# Altium project smart-clock-main-board.PrjPcb
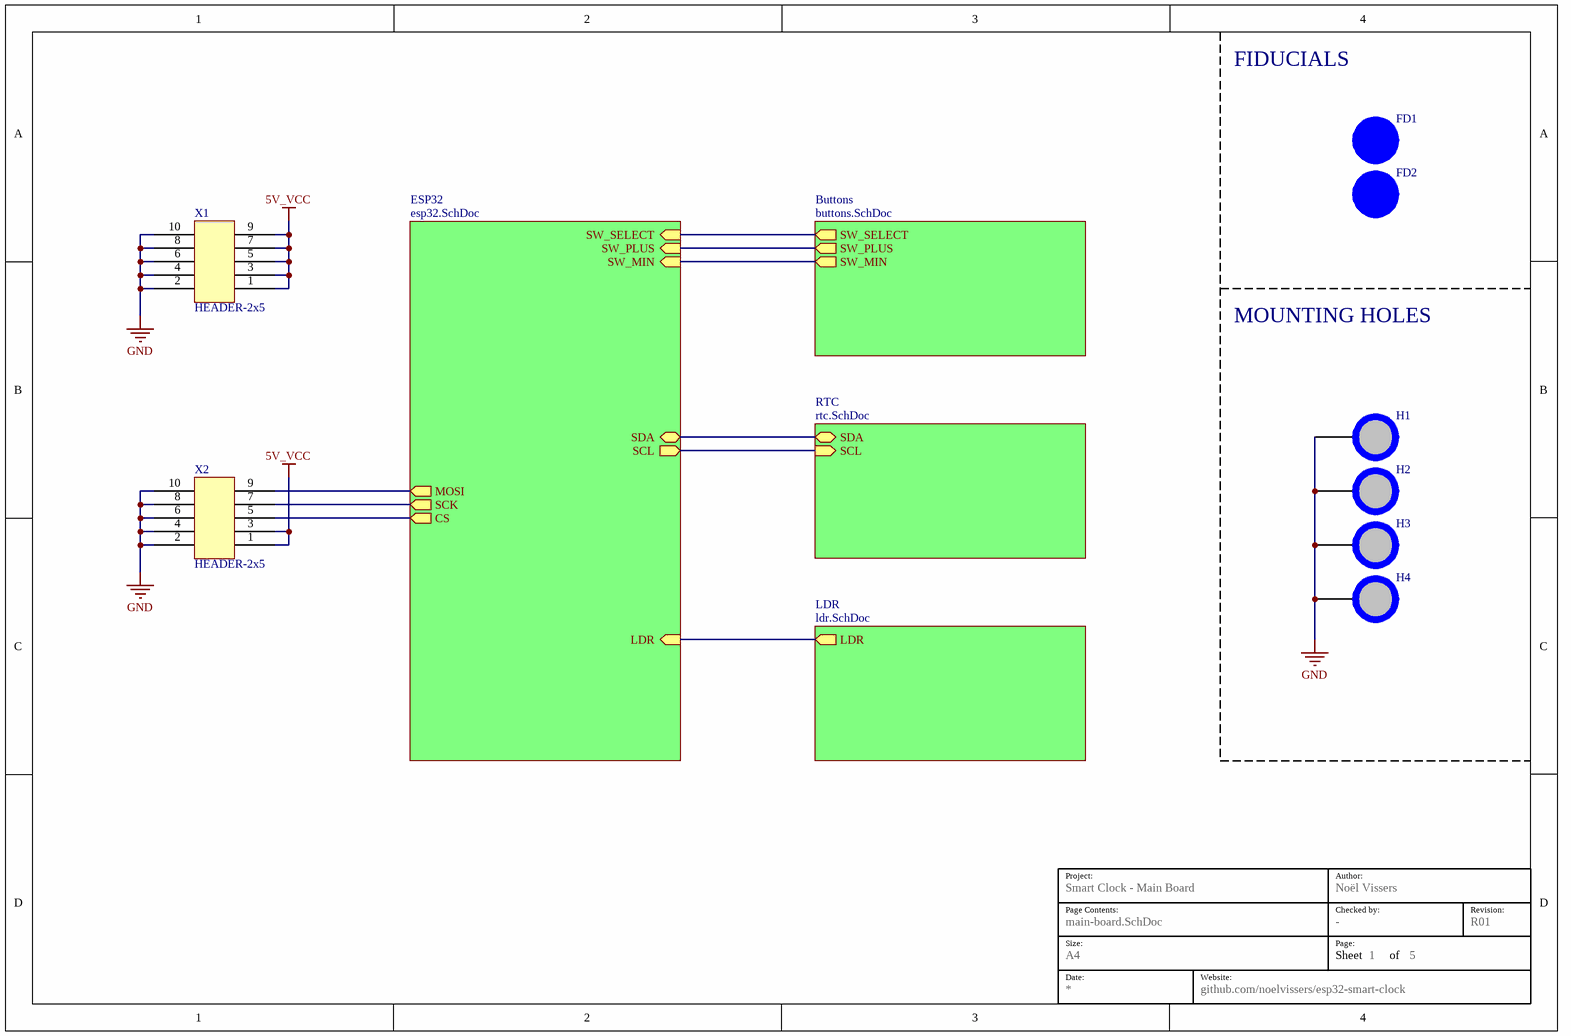
[diagram p0: main-board.SchDoc]
PrjAuthor: Noël Vissers; PrjCheckedBy: -; PrjName: Smart Clock - Main Board; PrjRevision: R01; PrjWebsite: github.com/noelvissers/esp32-smart-clock
5 sheets, 31 parts. Net scope: hierarchical (ports join the sheet entries above them; power ports are global).
Board file: smart-clock-main-board.PcbDoc
Sheets:
  main-board.SchDoc
    ESP32 = esp32.SchDoc
    Buttons = buttons.SchDoc
    LDR = ldr.SchDoc
    RTC = rtc.SchDoc

## Sheet main-board.SchDoc
size A4; DocumentNumber: 1; SheetNumber: 1; SheetTotal: 5

### Parts
*  Size: A4  (hidden comment: TITLE BLOCK)  (graphical)
FD1  FD  [FD]  (value not drawn)
FD2  FD  [FD]  (value not drawn)
H1  SIZE  [HOLE]  (value not drawn)
H2  SIZE  [HOLE]  (value not drawn)
H3  SIZE  [HOLE]  (value not drawn)
H4  SIZE  [HOLE]  (value not drawn)
X1  HEADER-2x5  [HEADER-2x5-FEMALE]
X2  HEADER-2x5  [HEADER-2x5-FEMALE]

### Sub-sheets
Buttons = buttons.SchDoc: SW_SELECT (out), SW_PLUS (out), SW_MIN (out)
ESP32 = esp32.SchDoc: CS (out), SCK (out), MOSI (out), SW_SELECT (in), SW_PLUS (in), SDA (bidir), LDR (in), SCL (out), SW_MIN (in)
LDR = ldr.SchDoc: LDR (out)
RTC = rtc.SchDoc: SDA (bidir), SCL (in)

### Nets
5V_VCC: X1.1 X1.3 X1.5 X1.7 X1.9 X2.1 X2.3
GND: H1.1 H2.1 H3.1 H4.1 X1.2 X1.4 X1.6 X1.8 X1.10 X2.2 X2.4 X2.6 X2.8 X2.10
NetC4000_1: sheet ESP32/SW_PLUS, sheet Buttons/SW_PLUS
NetC4001_1: sheet ESP32/SW_SELECT, sheet Buttons/SW_SELECT
NetC4002_1: sheet ESP32/SW_MIN, sheet Buttons/SW_MIN
NetR3000_2: sheet ESP32/LDR, sheet LDR/LDR
NetU1000_22: sheet ESP32/SCL, sheet RTC/SCL
NetU1000_25: sheet ESP32/SDA, sheet RTC/SDA
NetU1001_1: X2.9 ; sheet ESP32/MOSI
NetU1001_3: X2.7 ; sheet ESP32/SCK
NetU1001_9: X2.5 ; sheet ESP32/CS

Not connected (* = marked no-connect by the designer): FD1 1; FD2 1

### Notes on the sheet
- FIDUCIALS
- MOUNTING HOLES
- (in symbol TITLE BLOCK) Project:; Author:; Page Contents:; Checked by:; Revision:; Size:; Page:; Sheet; of; Date:; Website:

### Library data of the parts
FD1 FD2 = FD: FIDUCIAL MARKER
H1-H4 = MOUNTING-HOLE: M3 MOUNTING HOLE WITH SCREW AND SPACER
X1 X2 = HEADER-2x5: 2.54mm HEADER 2x5; System: Connector

## Sheet esp32.SchDoc
size A4; DocumentNumber: 2; SheetNumber: 2; SheetTotal: 5
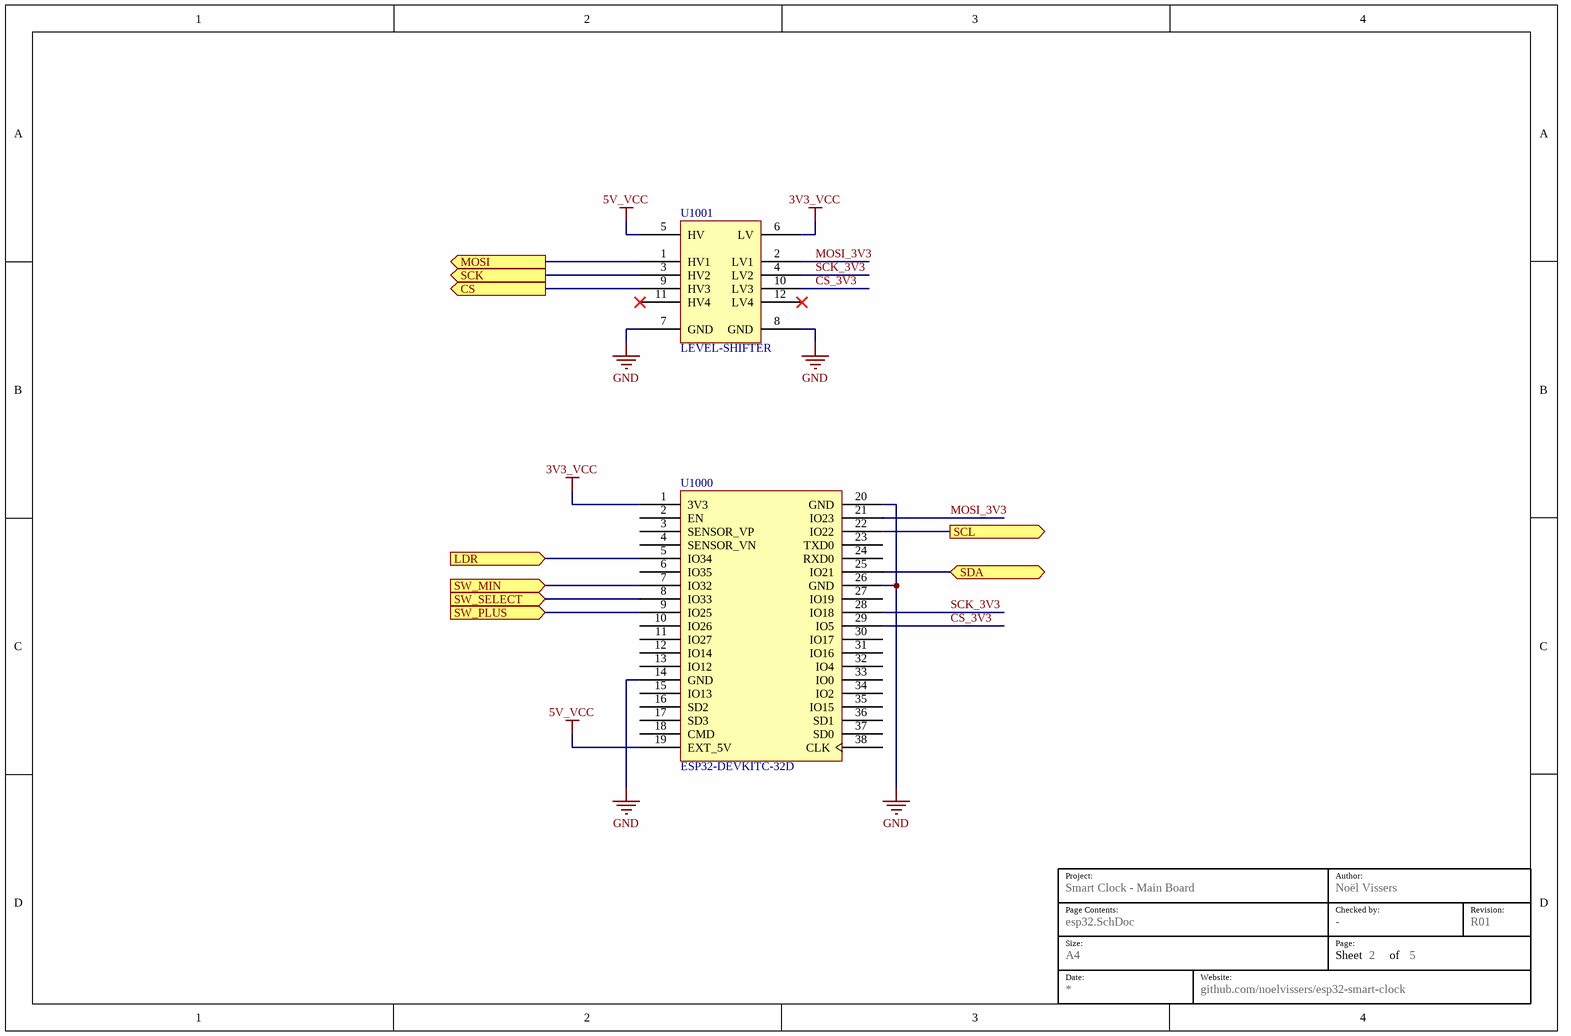
[diagram p1: esp32.SchDoc]

### Parts
(Parts that share a designator on the sheet are numbered #1, #2 ... from top to bottom, then left to right.)
*?#1  Size: A4  (hidden comment: TITLE BLOCK)  (graphical)
U1000  ESP32-DEVKITC-32D  [ESP32-DEVKITC-32D]
U1001  LEVEL-SHIFTER  [LEVEL-SHIFTER]

### Ports
CS (out), LDR (in), MOSI (out), SCK (out), SCL (out), SDA (bidir), SW_MIN (in), SW_PLUS (in), SW_SELECT (in)

### Nets
3V3_VCC: U1000.1(3V3) U1001.6(LV)
5V_VCC: U1000.19(EXT_5V) U1001.5(HV)
GND: U1000.14(GND) U1000.20(GND) U1000.26(GND) U1001.7(GND) U1001.8(GND)
CS_3V3: U1000.29(IO5) U1001.10(LV3)
MOSI_3V3: U1000.21(IO23) U1001.2(LV1)
SCK_3V3: U1000.28(IO18) U1001.4(LV2)
NetC4000_1: U1000.9(IO25) ; port SW_PLUS
NetC4001_1: U1000.8(IO33) ; port SW_SELECT
NetC4002_1: U1000.7(IO32) ; port SW_MIN
NetR3000_2: U1000.5(IO34) ; port LDR
NetU1000_22: U1000.22(IO22) ; port SCL
NetU1000_25: U1000.25(IO21) ; port SDA
NetU1001_1: U1001.1(HV1) ; port MOSI
NetU1001_3: U1001.3(HV2) ; port SCK
NetU1001_9: U1001.9(HV3) ; port CS

Not connected (* = marked no-connect by the designer): U1000 2(EN) 3(SENSOR_VP) 4(SENSOR_VN) 6(IO35) 10(IO26) 11(IO27) 12(IO14) 13(IO12) 15(IO13) 16(SD2) 17(SD3) 18(CMD) 23(TXD0) 24(RXD0) 27(IO19) 30(IO17) 31(IO16) 32(IO4) 33(IO0) 34(IO2) 35(IO15) 36(SD1) 37(SD0) 38(CLK); U1001 11(HV4)* 12(LV4)*

### Notes on the sheet
- (in symbol TITLE BLOCK) Project:; Author:; Page Contents:; Checked by:; Revision:; Size:; Page:; Sheet; of; Date:; Website:

### Library data of the parts
U1000 = ESP32-DEVKITC-32D: MF: Espressif Systems; Package: None; Price: None; Availability: Unavailable; MP: ESP32-DEVKITC-32D; SnapEDA_Link: https://www.snapeda.com/parts/ESP32-DEVKITC-32D/Espressif%20Systems/view-part/2777395/?ref=snap; Value: *
U1001 = LEVEL-SHIFTER: BI-DIRECTIONAL LEVEL SHIFTER

## Sheet buttons.SchDoc
size A4; DocumentNumber: 3; SheetNumber: 3; SheetTotal: 5
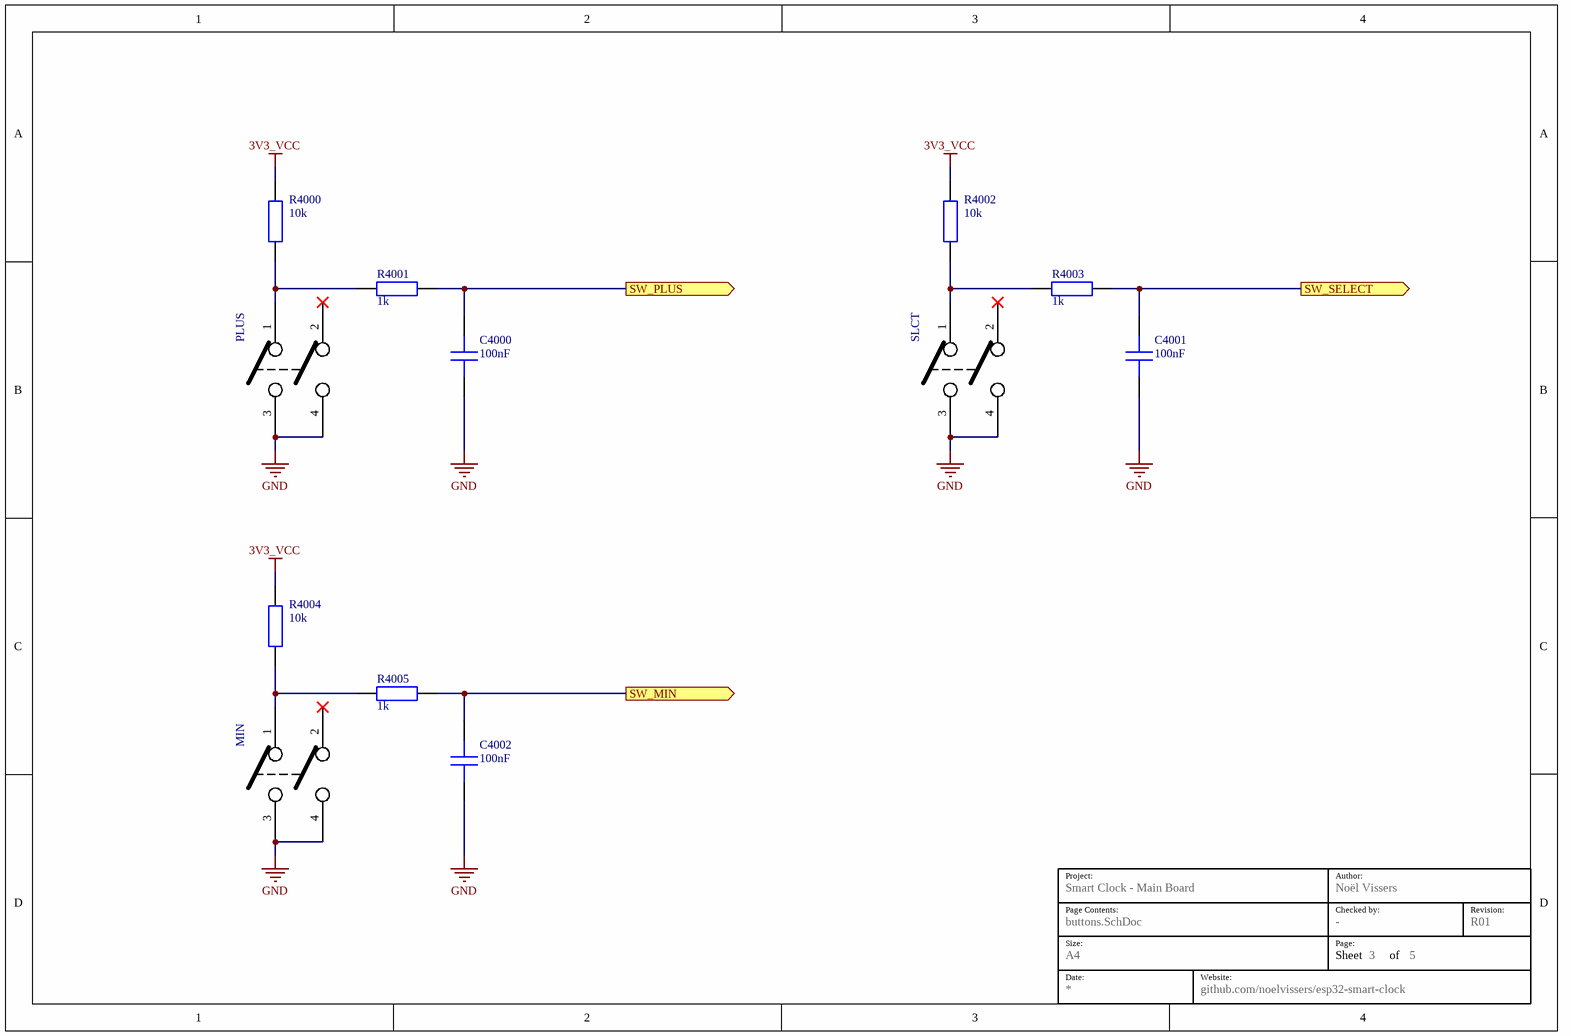
[diagram p2: buttons.SchDoc]

### Parts
(Parts that share a designator on the sheet are numbered #1, #2 ... from top to bottom, then left to right.)
*?#2  Size: A4  (hidden comment: TITLE BLOCK)  (graphical)
C4000  100nF  [TH-CAPACITOR - ANGLE]
C4001  100nF  [TH-CAPACITOR - ANGLE]
C4002  100nF  [TH-CAPACITOR - ANGLE]
MIN  PUSHBUTTON  [TH-PUSHBUTTON]  (value not drawn)
PLUS  PUSHBUTTON  [TH-PUSHBUTTON]  (value not drawn)
R4000  10k  [AXIAL RESISTOR]
R4001  1k  [AXIAL RESISTOR]
R4002  10k  [AXIAL RESISTOR]
R4003  1k  [AXIAL RESISTOR]
R4004  10k  [AXIAL RESISTOR]
R4005  1k  [AXIAL RESISTOR]
SLCT  PUSHBUTTON  [TH-PUSHBUTTON]  (value not drawn)

### Ports
SW_MIN (out), SW_PLUS (out), SW_SELECT (out)

### Nets
3V3_VCC: R4000.1 R4002.1 R4004.1
GND: C4000.2 C4001.2 C4002.2 MIN.3 MIN.4 PLUS.3 PLUS.4 SLCT.3 SLCT.4
NetC4000_1: C4000.1 R4001.1 ; port SW_PLUS
NetC4001_1: C4001.1 R4003.1 ; port SW_SELECT
NetC4002_1: C4002.1 R4005.1 ; port SW_MIN
NetMIN_1: MIN.1 R4004.2 R4005.2
NetPLUS_1: PLUS.1 R4000.2 R4001.2
NetR4002_2: R4002.2 R4003.2 SLCT.1

Not connected (* = marked no-connect by the designer): MIN 2*; PLUS 2*; SLCT 2*

### Notes on the sheet
- (in symbol TITLE BLOCK) Project:; Author:; Page Contents:; Checked by:; Revision:; Size:; Page:; Sheet; of; Date:; Website:

### Library data of the parts
C4000-C4002 = CAPACITOR: GENERIC CAPACITOR
R4000-R4005 = RESISTOR: GENERIC RESISTOR

## Sheet ldr.SchDoc
size A4; DocumentNumber: 5; SheetNumber: 5; SheetTotal: 5
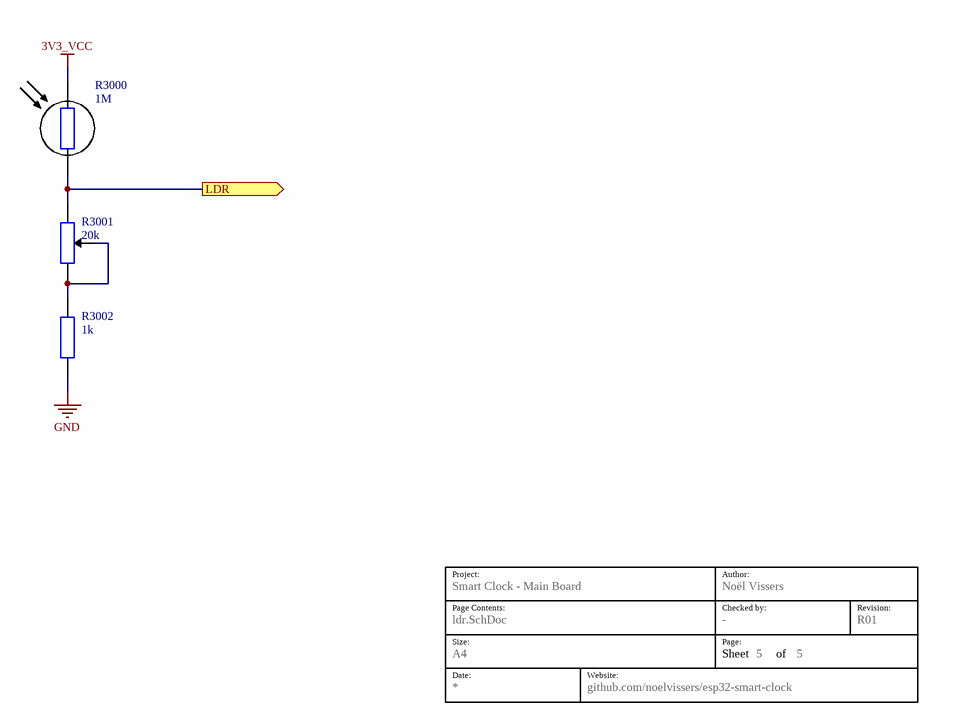
[diagram p3: ldr.SchDoc]

### Parts
(Parts that share a designator on the sheet are numbered #1, #2 ... from top to bottom, then left to right.)
*?#3  Size: A4  (hidden comment: TITLE BLOCK)  (graphical)
R3000  1M  [TH-LDR]
R3001  20k  [POTENTIOMETER]
R3002  1k  [AXIAL RESISTOR]

### Ports
LDR (out)

### Nets
3V3_VCC: R3000.1
GND: R3002.2
NetR3000_2: R3000.2 R3001.1 ; port LDR
NetR3001_2: R3001.2 R3001.3 R3002.1

### Notes on the sheet
- (in symbol TITLE BLOCK) Project:; Author:; Page Contents:; Checked by:; Revision:; Size:; Page:; Sheet; of; Date:; Website:

### Library data of the parts
R3000 = LDR: LIGHT DEPENDENT RESISTOR
R3001 = POTMETER
R3002 = RESISTOR: GENERIC RESISTOR

## Sheet rtc.SchDoc
size A4; DocumentNumber: 4; SheetNumber: 4; SheetTotal: 5
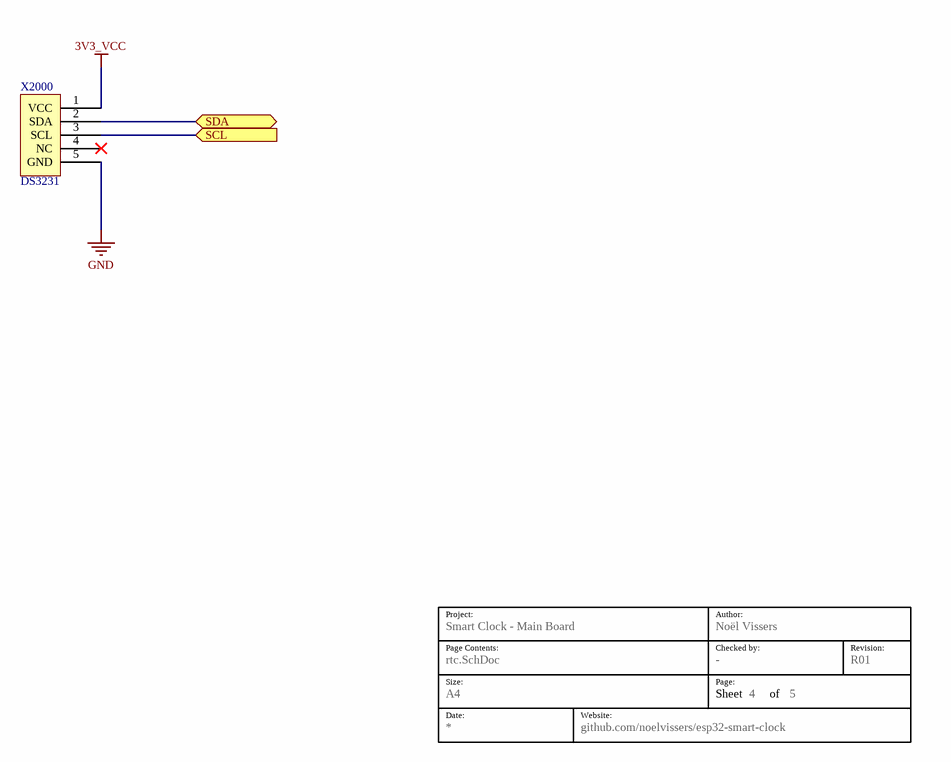
[diagram p4: rtc.SchDoc]

### Parts
(Parts that share a designator on the sheet are numbered #1, #2 ... from top to bottom, then left to right.)
*?#4  Size: A4  (hidden comment: TITLE BLOCK)  (graphical)
X2000  DS3231  [DS3231-MINI]

### Ports
SCL (in), SDA (bidir)

### Nets
3V3_VCC: X2000.1(VCC)
GND: X2000.5(GND)
NetU1000_22: X2000.3(SCL) ; port SCL
NetU1000_25: X2000.2(SDA) ; port SDA

Not connected (* = marked no-connect by the designer): X2000 4(NC)*

### Notes on the sheet
- (in symbol TITLE BLOCK) Project:; Author:; Page Contents:; Checked by:; Revision:; Size:; Page:; Sheet; of; Date:; Website:

### Library data of the parts
X2000 = DS3231-MINI-HEADER: DS3231 REAL TIME CLOCK

## Nets that join several sheets
3V3_VCC: esp32 (U1000.1 U1001.6), buttons (R4000.1 R4002.1 R4004.1), ldr (R3000.1), rtc (X2000.1)
5V_VCC: main-board (7 pins), esp32 (U1000.19 U1001.5)
GND: main-board (14 pins), esp32 (5 pins), buttons (9 pins), ldr (R3002.2), rtc (X2000.5)
NetC4000_1: esp32 (U1000.9), buttons (C4000.1 R4001.1)
NetC4001_1: esp32 (U1000.8), buttons (C4001.1 R4003.1)
NetC4002_1: esp32 (U1000.7), buttons (C4002.1 R4005.1)
NetR3000_2: esp32 (U1000.5), ldr (R3000.2 R3001.1)
NetU1000_22: esp32 (U1000.22), rtc (X2000.3)
NetU1000_25: esp32 (U1000.25), rtc (X2000.2)
NetU1001_1: main-board (X2.9), esp32 (U1001.1)
NetU1001_3: main-board (X2.7), esp32 (U1001.3)
NetU1001_9: main-board (X2.5), esp32 (U1001.9)